# Altium schematic sheet Sheet2.SchDoc
size A4; SheetNumber: 2; SheetTotal: 2
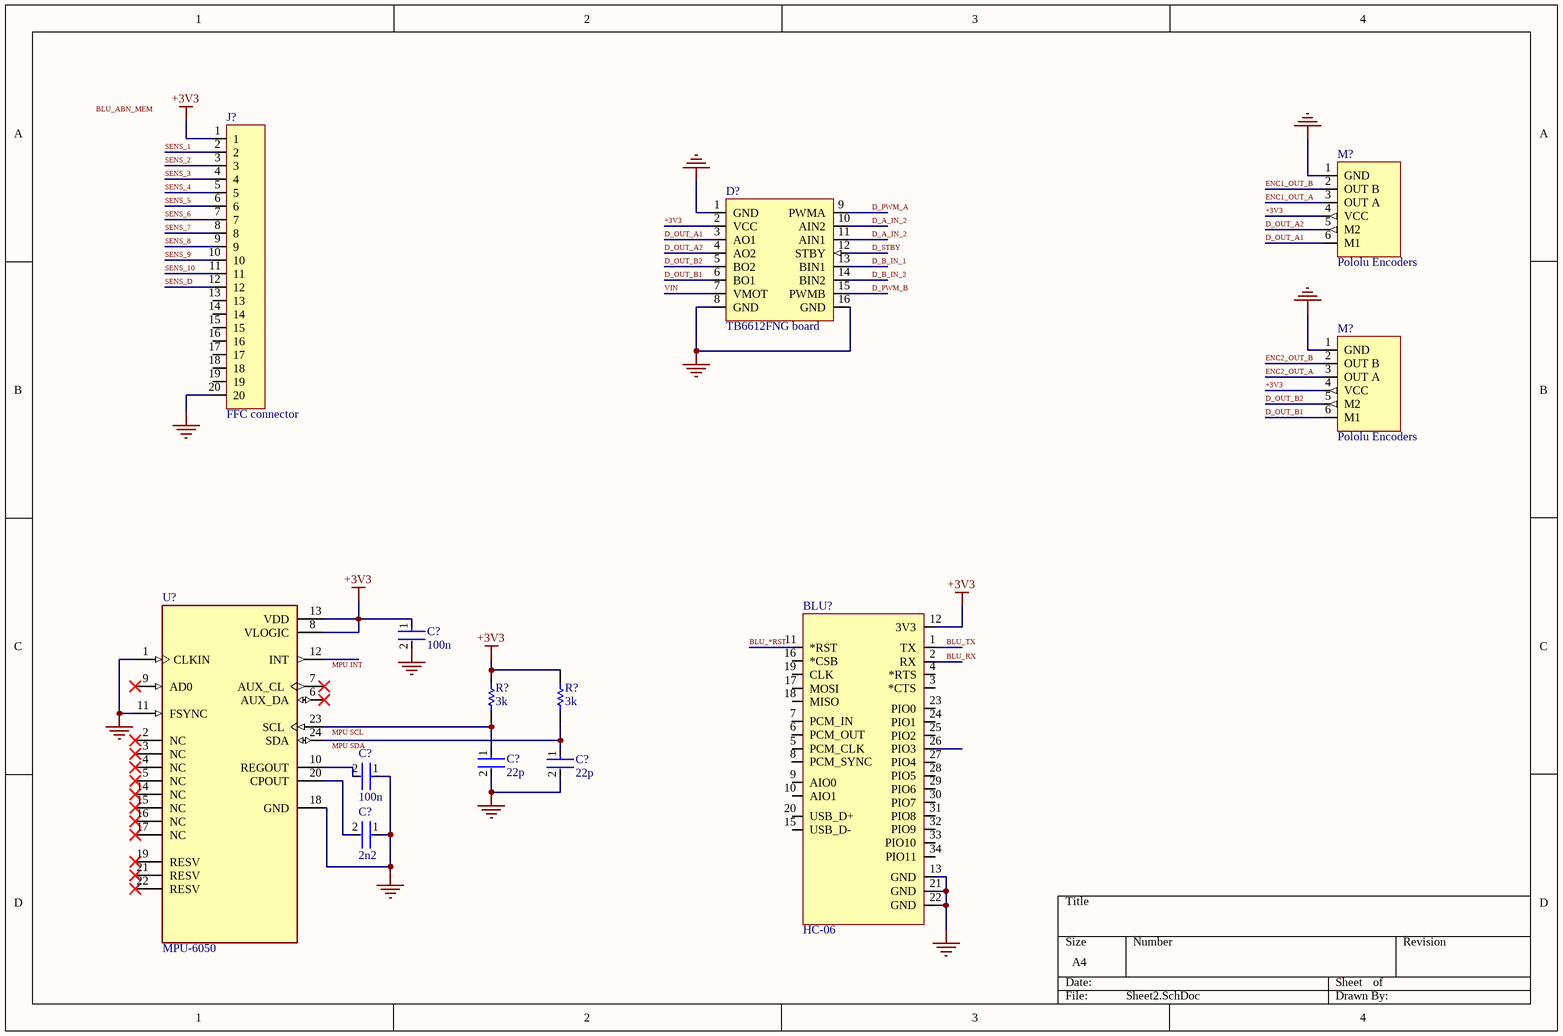
[diagram p0: Sheet2.SchDoc]

## Parts
(Parts that share a designator on the sheet are numbered #1, #2 ... from top to bottom, then left to right.)
BLU?  HC-06
C?#1  100n  [FP-CC0805-0_85-MFG]
C?#2  22p  [FP-CC0805-0_85-MFG]
C?#3  22p  [FP-CC0805-0_85-MFG]
C?#4  100n  [FP-CC0805-0_85-MFG]
C?#5  2n2  [FP-CC0805-0_85-MFG]
D?  TB6612FNG board  [TB6612FNG board footprint]
J?  FFC connector  [GCT_FFC2B35-20-G_REVA2]
M?#1  Pololu Encoders  [Encoders Pololu footprint]
M?#2  Pololu Encoders  [Encoders Pololu footprint]
R?#1  3k  [RESC2013X60X35NL10T20]
R?#2  3k  [RESC2013X60X35NL10T20]
U?  MPU-6050  [QFN50P400X400X95-24N]

## Nets
+3V3: BLU?.12(3V3) C?#1.1 D?.2(VCC) J?.1 M?#1.4(VCC) M?#2.4(VCC) R?#1.1 R?#2.1 U?.8(VLOGIC) U?.13(VDD)
GND: BLU?.13(GND) BLU?.21(GND) BLU?.22(GND) C?#1.2 C?#2.2 C?#3.2 C?#4.1 C?#5.1 D?.1(GND) D?.8(GND) D?.16(GND) J?.20 M?#1.1(GND) M?#2.1(GND) U?.1(CLKIN) U?.11(FSYNC) U?.18(GND)
BLU_*RST: BLU?.11(*RST)
BLU_RX: BLU?.2(RX)
BLU_TX: BLU?.1(TX)
D_A_IN_2: D?.10(AIN2) D?.11(AIN1)
D_B_IN_1: D?.13(BIN1)
D_B_IN_2: D?.14(BIN2)
D_OUT_A1: D?.3(AO1) M?#1.6(M1)
D_OUT_A2: D?.4(AO2) M?#1.5(M2)
D_OUT_B1: D?.6(BO1) M?#2.6(M1)
D_OUT_B2: D?.5(BO2) M?#2.5(M2)
D_PWM_A: D?.9(PWMA)
D_PWM_B: D?.15(PWMB)
D_STBY: D?.12(STBY)
ENC1_OUT_A: M?#1.3(OUT_A)
ENC1_OUT_B: M?#1.2(OUT_B)
ENC2_OUT_A: M?#2.3(OUT_A)
ENC2_OUT_B: M?#2.2(OUT_B)
MPU INT: U?.12(INT)
MPU SCL: C?#2.1 R?#1.2 U?.23(SCL)
MPU SDA: C?#3.1 R?#2.2 U?.24(SDA)
SENS_1: J?.2
SENS_2: J?.3
SENS_3: J?.4
SENS_4: J?.5
SENS_5: J?.6
SENS_6: J?.7
SENS_7: J?.8
SENS_8: J?.9
SENS_9: J?.10
SENS_10: J?.11
SENS_D: J?.12
VIN: D?.7(VMOT)
NetC?#4_2: C?#4.2 U?.10(REGOUT)
NetC?#5_2: C?#5.2 U?.20(CPOUT)

Not connected (* = marked no-connect by the designer): BLU? 3(*CTS) 4(*RTS) 5(PCM_CLK) 6(PCM_OUT) 7(PCM_IN) 8(PCM_SYNC) 9(AIO0) 10(AIO1) 15(USB_D-) 16(*CSB) 17(MOSI) 18(MISO) 19(CLK) 20(USB_D+) 23(PIO0) 24(PIO1) 25(PIO2) 26(PIO3) 27(PIO4) 28(PIO5) 29(PIO6) 30(PIO7) 31(PIO8) 32(PIO9) 33(PIO10) 34(PIO11); J? 13 14 15 16 17 18 19; U? 2(NC)* 3(NC)* 4(NC)* 5(NC)* 6(AUX_DA)* 7(AUX_CL)* 9(AD0)* 14(NC)* 15(NC)* 16(NC)* 17(NC)* 19(RESV)* 21(RESV)* 22(RESV)*

## Notes on the sheet
- Labels drawn without touching a wire or pin: BLU_ABN_MEM

## Library data of the parts
BLU? = BLUETOOTH-SERIAL-HC-06
C?#1-C?#5 = CMP-1036-04402-6: CAP CER 0.1UF 16V X7R 0805; Manufacturer Part Number: CC0805KRX7R7BB104; Manufacturer: Yageo; Material: Ceramic; Tolerance: 0.1; Capacitance: 100 nF; Value: 100 nF; Temperature: -30°C to +85°C; Lead Free: Yes; Footprint Url: http://www.yageo.com/exep/pages/download/literatures/UPY-C_GEN_24.pdf; Voltage Rating: 16 V; Package: CC0805-0.85; RoHS: TRUE; Digikey Description: CAP CER 0.1UF 16V X7R 0805; Category: Cap; Octopart: https://octopart.com/cc0805krx7r7bb104-yageo-39467769; Device Class L3: Ceramic Capacitors; ComponentLink2URL: http://www.yageo.com/documents/recent/UPY-GPHC_Y5V_6.3V-to-50V_8.pdf; Temperature Range Low: -30°C; Mouser Description: Multilayer Ceramic Capacitors MLCC - SMD/SMT 100nF 16V X7R 10%; Automotive: No; Device Class L2: Capacitors; Height: 0.95mm; ComponentLink2Description: Datasheet; Temperature Characteristic: X7R; Ipc Land Pattern Name: CAPC200125X85; Device Class L1: Passive Components; Temperature Range High: +85°C
J? = FFC2B35-20-G
R?#1 R?#2 = CMP-1659-00013-4: Chip Resistor, 10 KOhm, +/- 1%, 0.125 W, -55 to 155 degC, 0805 (2012 Metric), RoHS, Tape and Reel; Manufacturer: Yageo; Voltage Rating: 150 V; Mount: Surface Mount; ComponentLink1Description: Manufacturer URL; ComponentLink2URL: http://www.yageo.com/documents/recent/PYu-RC_Group_51_RoHS_L_04.pdf; Pins: 2; Length: 2 mm; Min Operating Temperature: -55 degC; Height: 0.5 mm; Mounting Technology: Surface Mount; RoHSCompliant: true; REACH SVHC: No SVHC; ComponentLink1URL: http://www.yageo.com/; Max Operating Temperature: 155 degC; PackageReference: 0805; DatasheetVersion: Rev. 4, 02/2016; Package Quantity: 5000; Packaging: Tape and Reel; ComponentLink2Description: Datasheet; PackageDescription: 2-Pin Surface Mounted Device, Body 2 x 1.25 mm
U? = MPU-6050: MPU-6050 series Accelerometer, Gyroscope, 3 Axis Sensor Evaluation Board; MF: TDK InvenSense; SnapEDA_Link: https://www.snapeda.com/parts/MPU-6050/TDK+InvenSense/view-part/?ref=snap; Package: QFN-24 InvenSense; Value: *; MP: MPU-6050; Check_prices: https://www.snapeda.com/parts/MPU-6050/TDK+InvenSense/view-part/?ref=eda